# Altium schematic sheet micro power.SchDoc
size 297 x 209 mm; SheetNumber: 2; SheetTotal: 2
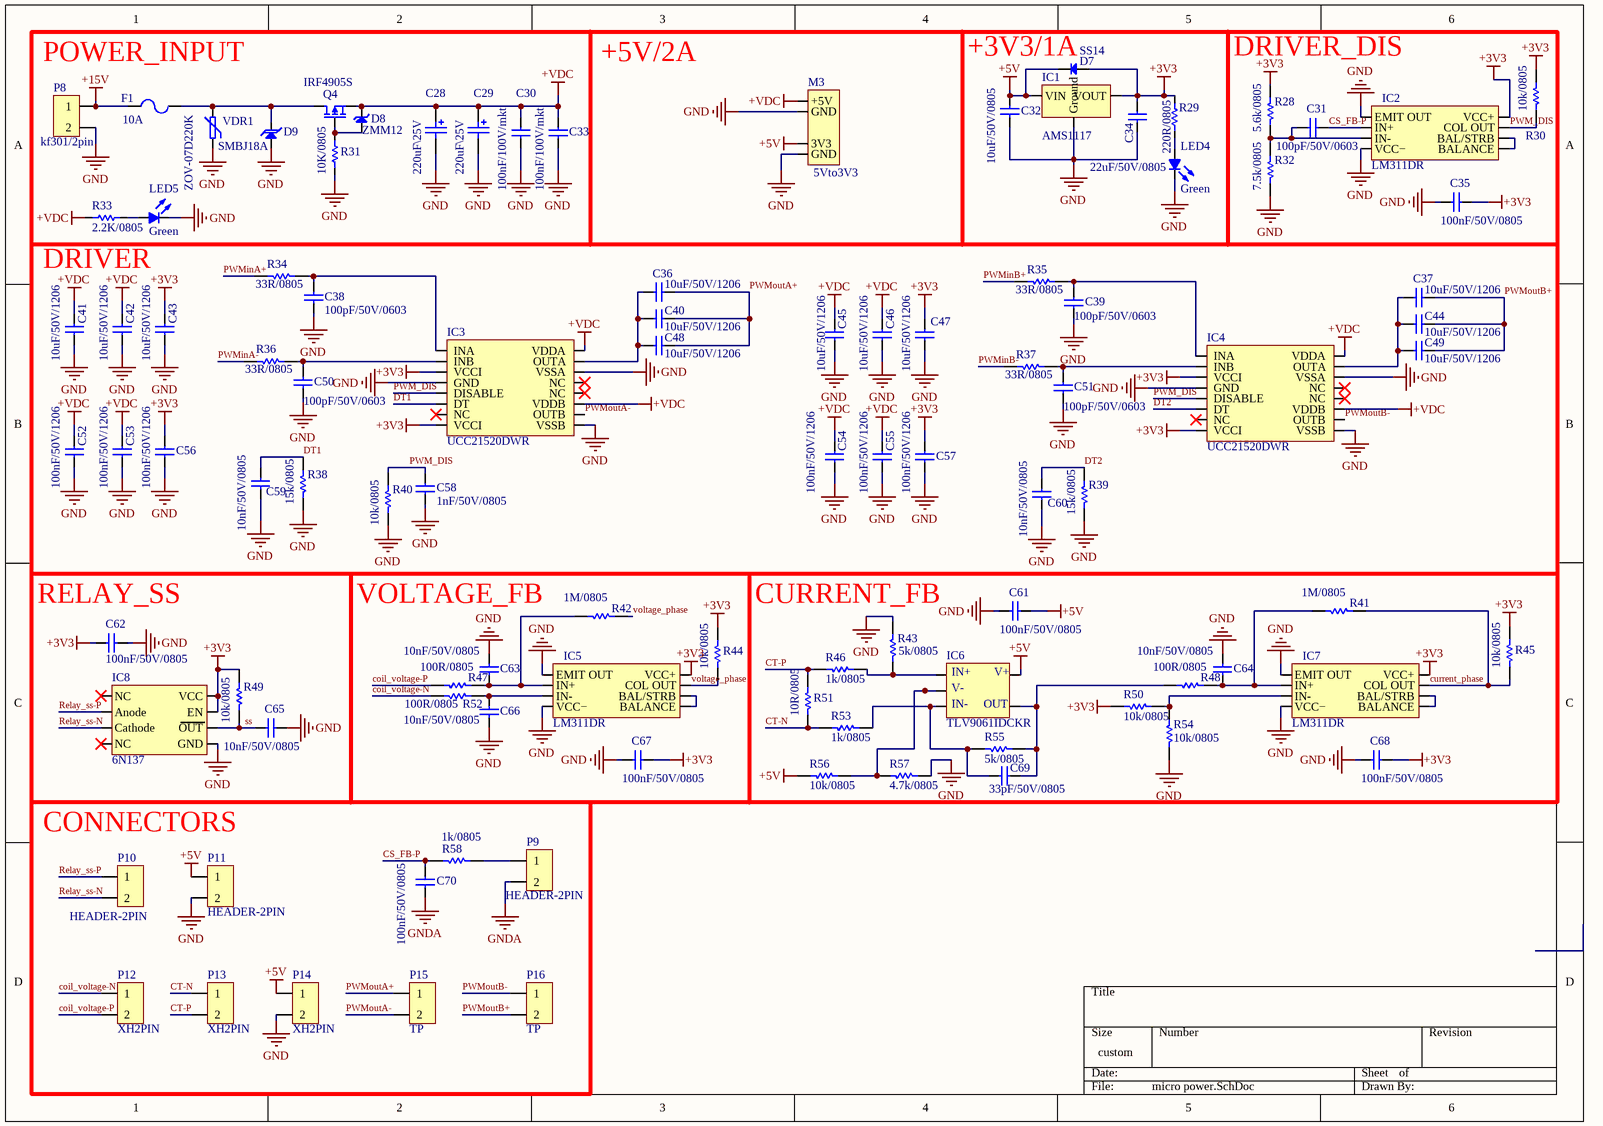
[diagram p0: micro power.SchDoc]

## Parts
C28  220uF\25V  [cap 5*11,p=2]
C29  220uF\25V  [cap 5*11,p=2]
C30  100nF/100V/mkt  [mkt 5mm]
C31  100pF/50V/0603  [cap 0603]
C32  10uF/50V/0805  [CAP 0805]
C33  100nF/100V/mkt  [mkt 5mm]
C34  22uF/50V/0805  [CAP 0805]
C35  100nF/50V/0805  [CAP 0805]
C36  10uF/50V/1206  [CAP 1206]
C37  10uF/50V/1206  [CAP 1206]
C38  100pF/50V/0603  [cap 0603]
C39  100pF/50V/0603  [cap 0603]
C40  10uF/50V/1206  [CAP 1206]
C41  10uF/50V/1206  [CAP 1206]
C42  10uF/50V/1206  [CAP 1206]
C43  10uF/50V/1206  [CAP 1206]
C44  10uF/50V/1206  [CAP 1206]
C45  10uF/50V/1206  [CAP 1206]
C46  10uF/50V/1206  [CAP 1206]
C47  10uF/50V/1206  [CAP 1206]
C48  10uF/50V/1206  [CAP 1206]
C49  10uF/50V/1206  [CAP 1206]
C50  100pF/50V/0603  [cap 0603]
C51  100pF/50V/0603  [cap 0603]
C52  100nF/50V/1206  [CAP 1206]
C53  100nF/50V/1206  [CAP 1206]
C54  100nF/50V/1206  [CAP 1206]
C55  100nF/50V/1206  [CAP 1206]
C56  100nF/50V/1206  [CAP 1206]
C57  100nF/50V/1206  [CAP 1206]
C58  1nF/50V/0805  [CAP 0805]
C59  10nF/50V/0805  [CAP 0805]
C60  10nF/50V/0805  [CAP 0805]
C61  100nF/50V/0805  [CAP 0805]
C62  100nF/50V/0805  [CAP 0805]
C63  10nF/50V/0805  [CAP 0805]
C64  10nF/50V/0805  [CAP 0805]
C65  10nF/50V/0805  [CAP 0805]
C66  10nF/50V/0805  [CAP 0805]
C67  100nF/50V/0805  [CAP 0805]
C68  100nF/50V/0805  [CAP 0805]
C69  33pF/50V/0805  [CAP 0805]
C70  100nF/50V/0805  [CAP 0805]
D7  SS14  [SMA]
D8  ZMM12  [minimelf]
D9  SMBJ18A  [SMB(DO-214AA)]
F1  10A  [smd Fuse Block 155 OMNI-BLOK]
IC1  AMS1117  [TO252 (DPAK) (Type TH)]
IC2  LM311DR  [SOIC-8]
IC3  UCC21520DWR  [SOIC16W]
IC4  UCC21520DWR  [SOIC16W]
IC5  LM311DR  [SOIC-8]
IC6  TLV9061IDCKR  [SC70-5]
IC7  LM311DR  [SOIC-8]
IC8  6N137  [SMD-8 Gull Wing]
LED4  COLOR: Green  [LED 3mm]  (hidden comment: LED 3mm/Green)
LED5  COLOR: Green  [LED 3mm]  (hidden comment: LED 3mm/Green)
M3  5Vto3V3  [5Vto3V3]
P8  kf301/2pin  [KF301-5.0-2P]
P9  HEADER-2PIN  [pin-header 2*1]
P10  HEADER-2PIN  [XH-2Pin]
P11  HEADER-2PIN  [pin-header 2*1]
P12  XH2PIN  [XH-2Pin]
P13  XH2PIN  [XH-2Pin]
P14  XH2PIN  [XH-2Pin]
P15  TP  [puls]
P16  TP  [puls]
Q4  IRF4905S  [TO263AB (D2PAK)]
R28  5.6k/0805  [RES 0805]
R29  220R/0805  [RES 0805]
R30  10k/0805  [RES 0805]
R31  10K/0805  [RES 0805]
R32  7.5k/0805  [RES 0805]
R33  2.2K/0805  [RES 0805]
R34  33R/0805  [RES 0805]
R35  33R/0805  [RES 0805]
R36  33R/0805  [RES 0805]
R37  33R/0805  [RES 0805]
R38  15k/0805  [RES 0805]
R39  15k/0805  [RES 0805]
R40  10k/0805  [RES 0805]
R41  1M/0805  [RES 0805]
R42  1M/0805  [RES 0805]
R43  5k/0805  [RES 0805]
R44  10k/0805  [RES 0805]
R45  10k/0805  [RES 0805]
R46  1k/0805  [RES 0805]
R47  100R/0805  [RES 0805]
R48  100R/0805  [RES 0805]
R49  10k/0805  [RES 0805]
R50  10k/0805  [RES 0805]
R51  10R/0805  [RES 0805]
R52  100R/0805  [RES 0805]
R53  1k/0805  [RES 0805]
R54  10k/0805  [RES 0805]
R55  5k/0805  [RES 0805]
R56  10k/0805  [RES 0805]
R57  4.7k/0805  [RES 0805]
R58  1k/0805  [RES 0805]
VDR1  ZOV-07D220K  [7D471K]

## Blocks framed on the sheet
POWER_INPUT: C28-C30 C33 D8 D9 F1 LED5 P8 Q4 R31 R33 VDR1

## Nets
+3V3: C34.1(+) C35.1(+) C43.2(-) C47.2(-) C56.2(-) C57.2(-) C62.1(+) C67.1(+) C68.1(+) D7.1 IC1.2(VOUT) IC2.8(VCC+) IC3.3(VCCI) IC3.8(VCCI) IC4.3(VCCI) IC4.8(VCCI) IC5.8(VCC+) IC7.8(VCC+) IC8.7(EN) IC8.8(VCC) R28.2 R29.2 R30.2 R44.2 R45.2 R49.2 R50.2
+5V: C32.1(+) C61.1(+) D7.2 IC1.3(VIN) IC6.5 M3.3(3V3) P11.1 P14.1 R56.1
+15V: F1.1 P8.1
+VDC: C28.1 C29.1 C30.1(+) C33.1(+) C41.2(-) C42.2(-) C45.2(-) C46.2(-) C52.2(-) C53.2(-) C54.2(-) C55.2(-) D8.2(K) IC3.11(VDDB) IC3.16(VDDA) IC4.11(VDDB) IC4.16(VDDA) M3.1(+5V) Q4.3(S) R33.2
GND: C28.2 C29.2 C30.2(-) C32.2(-) C33.2(-) C34.2(-) C35.2(-) C38.2(-) C39.2(-) C41.1(+) C42.1(+) C43.1(+) C45.1(+) C46.1(+) C47.1(+) C50.2(-) C51.2(-) C52.1(+) C53.1(+) C54.1(+) C55.1(+) C56.1(+) C57.1(+) C58.1(+) C59.1(+) C60.1(+) C61.2(-) C62.2(-) C63.1(+) C64.1(+) C65.1(+) C66.2(-) C67.2(-) C68.2(-) D9.1 IC1.1(Ground) IC2.1(EMIT_OUT) IC2.4(VCC−) IC3.4(GND) IC3.9(VSSB) IC3.14(VSSA) IC4.4(GND) IC4.9(VSSB) IC4.14(VSSA) IC5.1(EMIT_OUT) IC5.4(VCC−) IC7.1(EMIT_OUT) IC7.4(VCC−) IC8.5(GND) LED4.2(K) LED5.2(K) M3.2(GND) M3.4(GND) P8.2 P11.2 P14.2 R31.1 R32.1 R38.2 R39.2 R40.1 R43.1 R54.2 R57.2 VDR1.2
GNDA: C70.2(-) P9.2
coil_voltage-N: P12.1 R52.2
coil_voltage-P: P12.2 R47.2
CS_FB-P: C31.2(-) C70.1(+) IC2.2(IN+) R58.2
CT-N: P13.1 R51.1 R53.2
CT-P: P13.2 R46.2 R51.2
current_phase: IC7.7(COL_OUT) R41.1 R45.1
DT1: C59.2(-) IC3.6(DT) R38.1
DT2: C60.2(-) IC4.6(DT) R39.1
PWM_DIS: C58.2(-) IC2.7(COL_OUT) IC3.5(DISABLE) IC4.5(DISABLE) R30.1 R40.2
PWMinA+: R34.2
PWMinA-: R36.2
PWMinB+: R35.2
PWMinB-: R37.2
PWMoutA+: C36.2(-) C40.2(-) C48.1(+) P15.1
PWMoutA-: IC3.10(OUTB) P15.2
PWMoutB+: C37.2(-) C44.2(-) C49.1(+) P16.2
PWMoutB-: IC4.10(OUTB) P16.1
Relay_ss-N: IC8.3(Cathode) P10.2
Relay_ss-P: IC8.2(Anode) P10.1
ss: C65.2(-) IC8.6(OUT) R49.1
voltage_phase: IC5.7(COL_OUT) R42.1 R44.1
NetC31_1: C31.1(+) IC2.3(IN-) R28.1 R32.2
NetC36_1: C36.1(+) C40.1(+) C48.2(-) IC3.15(OUTA)
NetC37_1: C37.1(+) C44.1(+) C49.2(-) IC4.15(OUTA)
NetC38_1: C38.1(+) IC3.1(INA) R34.1
NetC39_1: C39.1(+) IC4.1(INA) R35.1
NetC50_1: C50.1(+) IC3.2(INB) R36.1
NetC51_1: C51.1(+) IC4.2(INB) R37.1
NetC63_2: C63.2(-) IC5.2(IN+) R42.2 R47.1
NetC64_2: C64.2(-) IC7.2(IN+) R41.2 R48.1
NetC66_1: C66.1(+) IC5.3(IN-) R52.1
NetC69_1: C69.1(+) IC6.4 R48.2 R55.2
NetC69_2: C69.2(-) IC6.3 R53.1 R55.1
NetD8_1: D8.1(A) Q4.1(G) R31.2
NetD9_2: D9.2 F1.2 Q4.2(D) VDR1.1
NetIC2_5: IC2.5(BALANCE) IC2.6(BAL/STRB)
NetIC5_5: IC5.5(BALANCE) IC5.6(BAL/STRB)
NetIC6_1: IC6.1 R43.2 R46.1
NetIC6_2: IC6.2 R56.2 R57.1
NetIC7_3: IC7.3(IN-) R50.1 R54.1
NetIC7_5: IC7.5(BALANCE) IC7.6(BAL/STRB)
NetLED4_1: LED4.1(A) R29.1
NetLED5_1: LED5.1(A) R33.1
NetP9_1: P9.1 R58.1

Not connected (* = marked no-connect by the designer): IC3 7(NC)* 12(NC)* 13(NC)*; IC4 7(NC)* 12(NC)* 13(NC)*; IC8 1(NC)* 4(NC)*

## Notes on the sheet
- +5V/2A
- (near D7) +3V3/1A
- DRIVER_DIS
- DRIVER
- (near C62) RELAY_SS
- VOLTAGE_FB
- (near R43) CURRENT_FB
- CONNECTORS
- (in symbol TLV9061IDCKR) IN+; V+; V-; IN-; OUT

## Library data of the parts
C28 C29 = Cap Pol1: Polarized Capacitor (Radial); Published: 8-Jun-2000; LatestRevisionDate: 17-Jul-2002; LatestRevisionNote: Re-released for DXP Platform.; PackageReference: RB7.6-15; Publisher: Altium Limited; PackageDescription: Polarized Capacitor (Radial); 2 Leads; Value: 220uF\25V
C30-C70 = Capacitor
D7 = Diode
D8 = ZENER
D9 = TVS_Unidirectional
F1 = Fuse
LED4 LED5 = LED: Typical LED
P8-P16 = Header 2H: RELAY; LatestRevisionDate: 17-Jul-2002; LatestRevisionNote: Re-released for DXP Platform.; Publisher: Altium Limited
Q4 = Mosfet P-channel: D2pak
R28 R30 R32 R34-R58 = Res1: Resistor; Published: 8-Jun-2000; LatestRevisionDate: 17-Jul-2002; LatestRevisionNote: Re-released for DXP Platform.; PackageReference: AXIAL-0.3; Publisher: Altium Limited; PackageDescription: Axial Device, Thru-Hole; 2 Leads; 0.3 in Pin Spacing
  R28: Value: 5.6k/0805
  R30 R40 R44 R45 R49 R50 R54 R56: Value: 10k/0805
  R32: Value: 7.5k/0805
  R34-R37: Value: 33R/0805
  R38 R39: Value: 15k/0805
  R41 R42: Value: 1M/0805
  R43 R55: Value: 5k/0805
  R46 R53 R58: Value: 1k/0805
  R47 R48 R52: Value: 100R/0805
  R51: Value: 10R/0805
  R57: Value: 4.7k/0805
R29 R31 R33 = Res
  R29: value: 220R/0805
  R31: value: 10K/0805
  R33: value: 2.2K/0805
VDR1 = VARISTOR (VDR): VARISTORS; Manufacturer: china-canada-philipina; Designer: Abbas Basereh; VALUE: xxDxxx; Models: MOV-VDR-COV; Data: 2017-1-5; Link: digikey.com; PUBLISHER: ABBAS BASEREH